# EAGLE schematic Relay-Control (EAGLE 7.2.0)
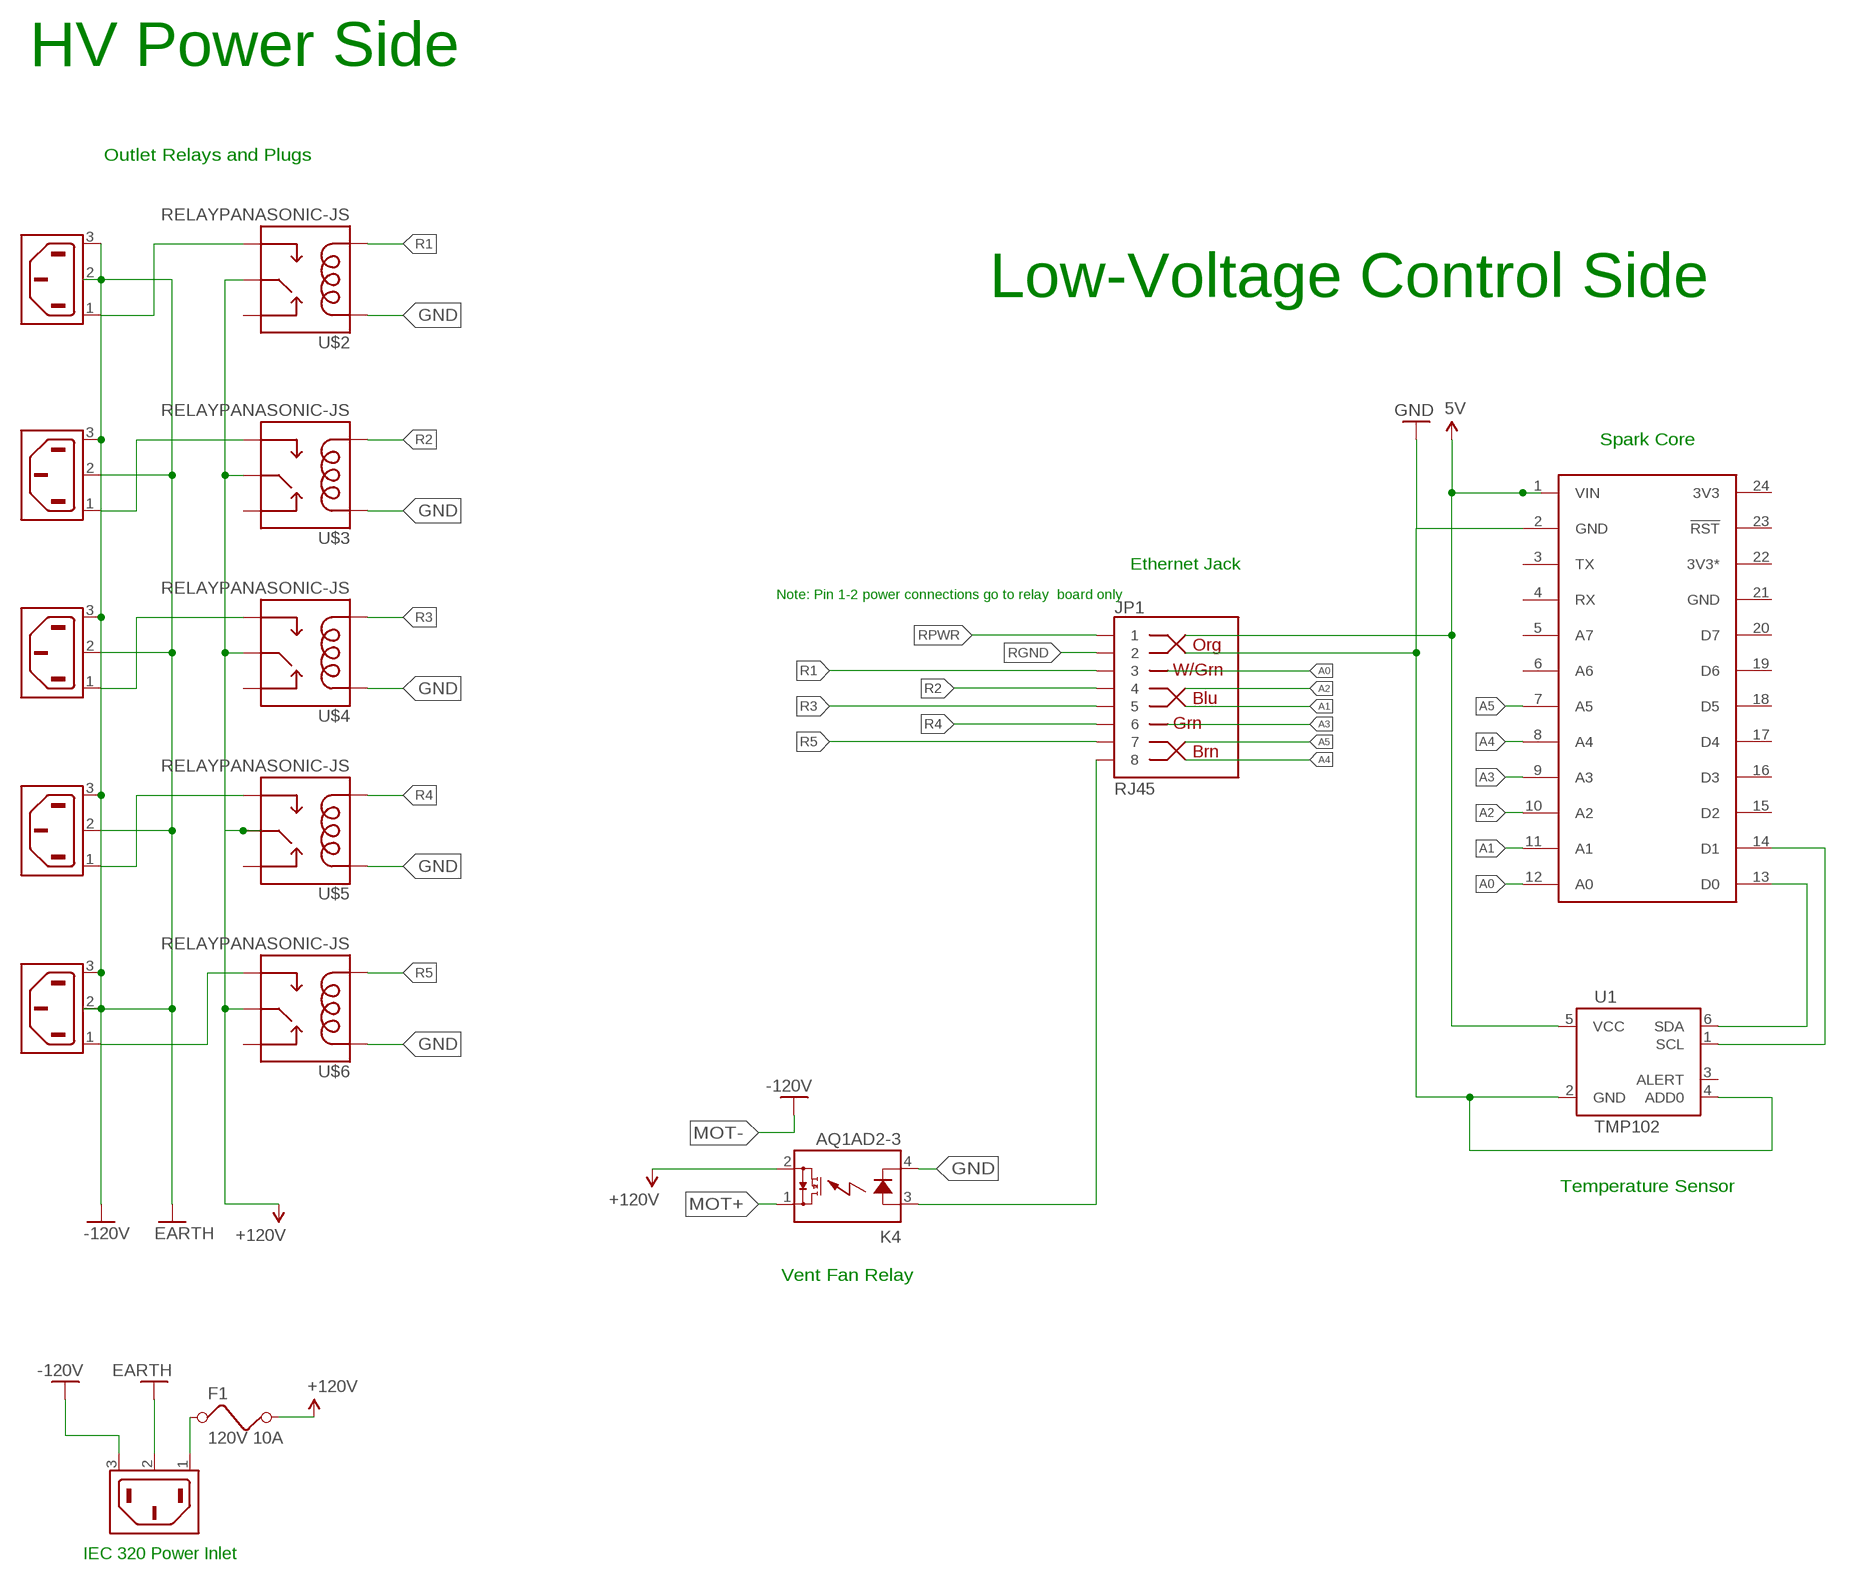
[diagram p0: schematic, sheet 1]

## Parts
F1  120V 10A  FUSE  [FUSE]
JP1  RJ45  RJ45-8PTH  [RJ45-8]
K4  AQ1AD2-3  [AQ1]
U1  TMP102  [SOT563]
U$1  SPARK_CORECORE  [SPARK_CORE]
U$2  RELAYPANASONIC-JS  [JS1-5V-F]
U$3  RELAYPANASONIC-JS  [JS1-5V-F]
U$4  RELAYPANASONIC-JS  [JS1-5V-F]
U$5  RELAYPANASONIC-JS  [JS1-5V-F]
U$6  RELAYPANASONIC-JS  [JS1-5V-F]
X1  6ESRM-P  [6ESRM-P]
X2  6ESRM-P  [6ESRM-P]
X3  6ESRM-P  [6ESRM-P]
X4  6ESRM-P  [6ESRM-P]
X5  6ESRM-P  [6ESRM-P]
X6  6ESRM-P  [6ESRM-P]

## Nets
5V: U1.5(VCC) U$1.1(VIN)
A0: U$1.12(A0)
A1: U$1.11(A1)
A2: U$1.10(A2)
A3: U$1.9(A3)
A4: U$1.8(A4)
A5: U$1.7(A5)
GND: K4.4(K) U1.2(GND) U1.4(ADD0) U$1.2(GND) U$2.COIL1 U$3.COIL1 U$4.COIL1 U$5.COIL1 U$6.COIL1 X1.2(SH) X1.3(AC2) X2.2(SH) X2.3(AC2) X3.2(SH) X3.3(AC2) X4.2(SH) X4.3(AC2) X5.2(SH) X5.3(AC2) X6.2(SH) X6.3(AC2) ; supply symbol labelled EARTH, -120V
MOT+: K4.1(DS1)
N$1: U1.1(SCL) U$1.14(D1)
N$2: U1.6(SDA) U$1.13(D0)
N$3: JP1.8 K4.3(A)
N$4: U$6.OPEN(NO) X5.1(AC1)
N$5: F1.1 X6.1(AC1)
N$11: U$5.OPEN(NO) X4.1(AC1)
N$12: U$4.OPEN(NO) X3.1(AC1)
N$13: U$3.OPEN(NO) X2.1(AC1)
N$15: U$2.OPEN(NO) X1.1(AC1)
R1: JP1.3 U$2.COIL2
R2: JP1.4 U$3.COIL2
R3: JP1.5 U$4.COIL2
R4: JP1.6 U$5.COIL2
R5: JP1.7 U$6.COIL2
RGND: JP1.2
RPWR: JP1.1
VCC: F1.2 K4.2(DS2) U$2.COMMON(MAIN) U$3.COMMON(MAIN) U$4.COMMON(MAIN) U$5.COMMON(MAIN) U$6.COMMON(MAIN) ; supply symbol labelled +120V
Unconnected: U1.3(ALERT) U$1.3(TX) U$1.4(RX) U$1.5(A7) U$1.6(A6) U$1.15(D2) U$1.16(D3) U$1.17(D4) U$1.18(D5) U$1.19(D6) U$1.20(D7) U$1.23(!RST) U$2.CLOSED(NC) U$3.CLOSED(NC) U$4.CLOSED(NC) U$5.CLOSED(NC) U$6.CLOSED(NC)

## Notes on the sheet
- HV Power Side
- Outlet Relays and Plugs
- Low-Voltage Control Side
- Spark Core
- Ethernet Jack
- Note: Pin 1-2 power connections go to relay  board only
- Temperature Sensor
- Vent Fan Relay
- IEC 320 Power Inlet

## Power pins joined to a net without a drawn wire
3V3: U$1.24(3V3)
3V3*: U$1.22(3V3*)
GND: U$1.21(GND)

## Library data of the parts
F1 = special:FUSE: FUSE 5 x 20 mm
JP1 = SparkFun-Connectors:RJ45-8: RJ45 Jack Simple RJ45, 8-pin connection - connector for common Cat5, Cat5e, and Cat6 Ethernet cables. Footprint not yet proven in production. Connector sku is PRT-00643; Breakout PCB sku is BOB-00716.; PROD_ID: CONN-08506
K4 = relay:AQ*: SOLID STATE RELAY NAiS Source: http://www.mew-europe.com/.. en_ds_61601_0000.pdf; MF: AROMAT/ MATSUSHITA; MPN: AQ1AD2-3/28VDC; OC_FARNELL: unknown; OC_NEWARK: 10C4052
U1 = SparkFun-Sensors:TMP102: I2C degC temp sensor; PROD_ID: IC-09303
U$1 = Spark:SPARK_CORE
U$2-U$6 = Spark:RELAY: SPDT relay (COM-00101)
X1-X6 = con-tycoelectronics:6ESRM-P: AC Connector 120/250 VAC Source: http://catalog.tycoelectronics.com .. ENG_DS_1654001_1099_SR_0406.pdf; MF: TYCO ELECTRONICS; MPN: 6ESRM-P; OC_FARNELL: unknown; OC_NEWARK: 87F1821